# Altium schematic sheet buffNlvlshifter2.SchDoc
size Letter
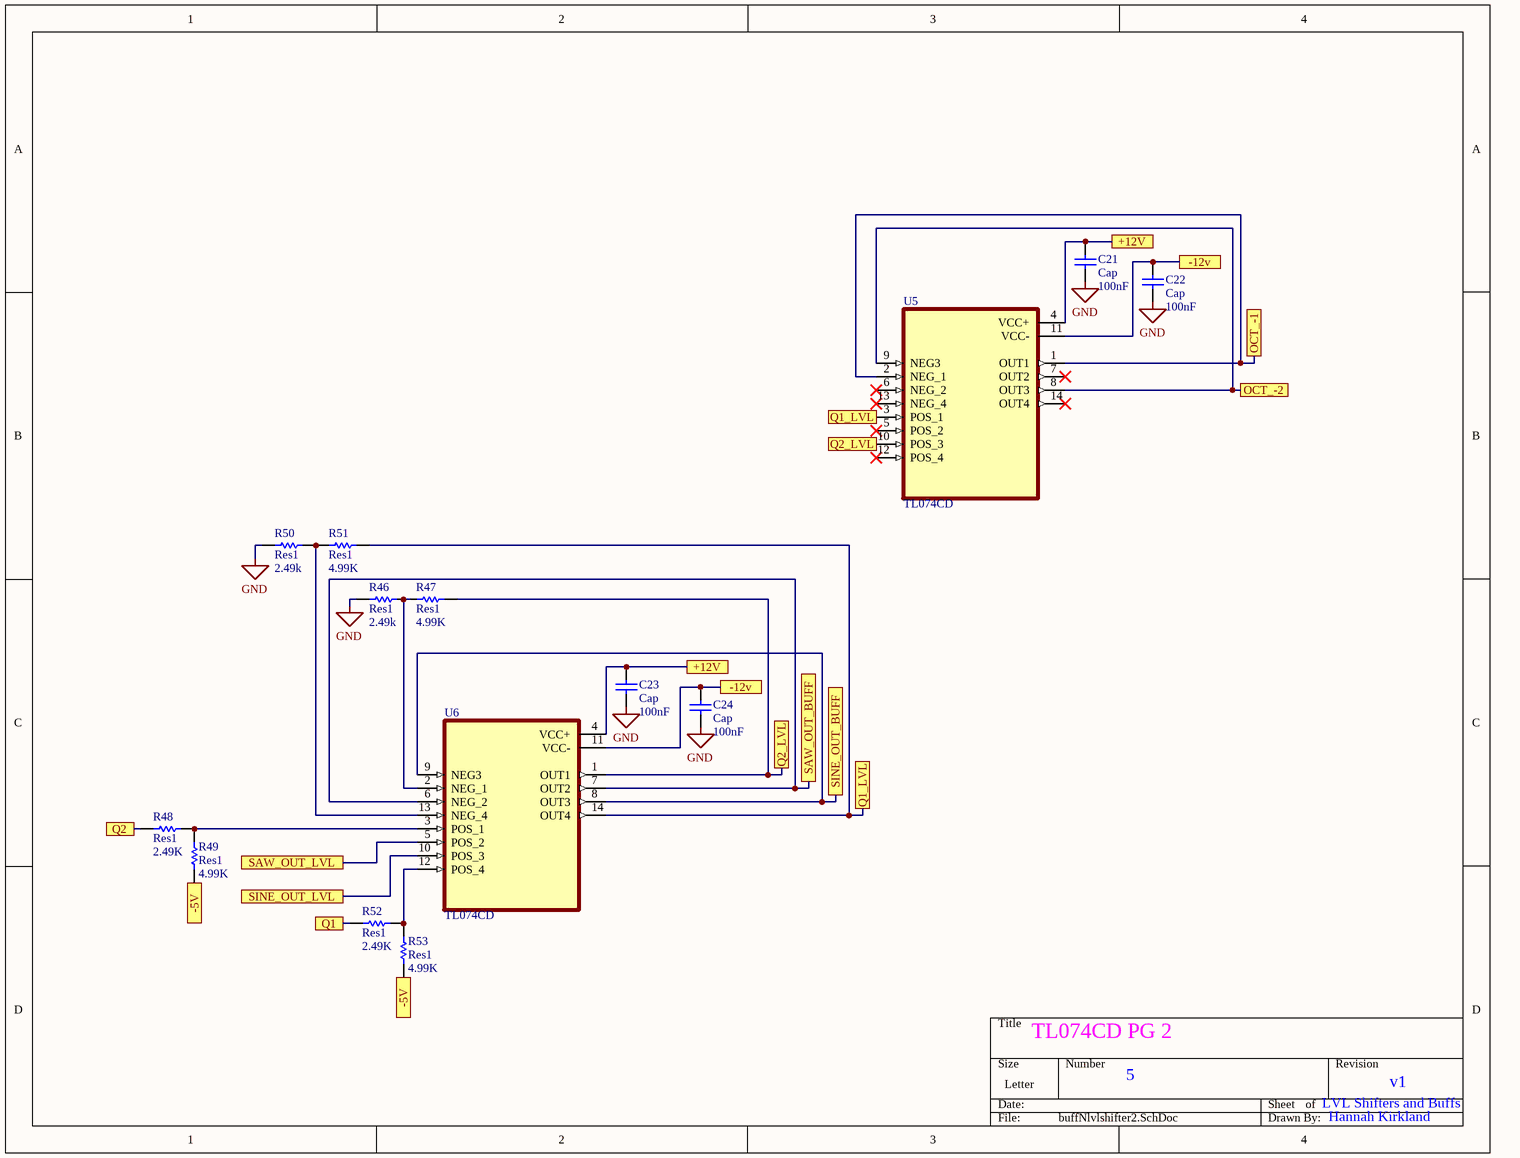
[diagram p0: buffNlvlshifter2.SchDoc]

## Parts
C21  Cap  value 100nF  [C1206]
C22  Cap  value 100nF  [C1206]
C23  Cap  value 100nF  [C1206]
C24  Cap  value 100nF  [C1206]
R46  Res1  value 2.49k  [C1206]
R47  Res1  value 4.99K  [C1206]
R48  Res1  value 2.49K  [C1206]
R49  Res1  value 4.99K  [C1206]
R50  Res1  value 2.49k  [C1206]
R51  Res1  value 4.99K  [C1206]
R52  Res1  value 2.49K  [C1206]
R53  Res1  value 4.99K  [C1206]
U5  TL074CD  [SOIC127P600X175-14N]
U6  TL074CD  [SOIC127P600X175-14N]

## Ports
+12V, -5V, -12v, OCT_-1, OCT_-2, Q1, Q1_LVL, Q2, Q2_LVL, SAW_OUT_BUFF, SAW_OUT_LVL, SINE_OUT_BUFF, SINE_OUT_LVL

## Nets
GND: C21.1 C22.1 C23.1 C24.1 R46.1 R50.1
+12V: C21.2 C23.2 U5.4(VCC+) U6.4(VCC+) ; port +12V
-5V: R49.1 R53.1 ; port -5V
-12v: C22.2 C24.2 U5.11(VCC-) U6.11(VCC-) ; port -12v
OCT_-1: U5.1(OUT1) U5.2(NEG_1) ; port OCT_-1
OCT_-2: U5.8(OUT3) U5.9(NEG3) ; port OCT_-2
Q1: R52.1 ; port Q1
Q1_LVL: R51.2 U5.3(POS_1) U6.14(OUT4) ; port Q1_LVL
Q2: R48.1 ; port Q2
Q2_LVL: R47.2 U5.10(POS_3) U6.1(OUT1) ; port Q2_LVL
SAW_OUT_BUFF: U6.6(NEG_2) U6.7(OUT2) ; port SAW_OUT_BUFF
SAW_OUT_LVL: U6.5(POS_2) ; port SAW_OUT_LVL
SINE_OUT_BUFF: U6.8(OUT3) U6.9(NEG3) ; port SINE_OUT_BUFF
SINE_OUT_LVL: U6.10(POS_3) ; port SINE_OUT_LVL
NetR46_2: R46.2 R47.1 U6.2(NEG_1)
NetR48_2: R48.2 R49.2 U6.3(POS_1)
NetR50_2: R50.2 R51.1 U6.13(NEG_4)
NetR52_2: R52.2 R53.2 U6.12(POS_4)

Not connected (* = marked no-connect by the designer): U5 5(POS_2)* 6(NEG_2)* 7(OUT2)* 12(POS_4)* 13(NEG_4)* 14(OUT4)*

## Notes on the sheet
- TL074CD PG 2
- 5
- LVL Shifters and Buffs
- v1
- Hannah Kirkland

## Library data of the parts
C21-C24 = Cap: Capacitor; Published: 8-Jun-2000; LatestRevisionDate: 17-Jul-2002; LatestRevisionNote: Re-released for DXP Platform.; PackageReference: RAD-0.3; Publisher: Altium Limited; PackageDescription: Radial Cap, Thru-Hole; 2 Leads; 0.3 in Pin Spacing
R46-R53 = Res1: Resistor; Published: 8-Jun-2000; LatestRevisionDate: 17-Jul-2002; LatestRevisionNote: Re-released for DXP Platform.; PackageReference: AXIAL-0.3; Publisher: Altium Limited; PackageDescription: Axial Device, Thru-Hole; 2 Leads; 0.3 in Pin Spacing
U5 U6 = TL074CD: Quad Low-Noise JFET-Input General-Purpose Operational Amplifier 14-SOIC 0 to 70; MF: Texas Instruments; Availability: Good; Mouser-Purchase-URL: https://snapeda.com/shop?store=Mouser&id=4793449; Value: *; SnapEDA_Link: https://www.snapeda.com/parts/TL074CD/Texas%20Instruments/view-part/4793449/?ref=snap; Texas_Instruments-Purchase-URL: https://snapeda.com/shop?store=Texas+Instruments&id=4793449; Price: None; Package: SOIC-14 Texas Instruments; MP: TL074CD; DigiKey-Purchase-URL: https://snapeda.com/shop?store=DigiKey&id=4793449; BuyPart: https://www.snapeda.com/parts/TL074CD/Texas%20Instruments/view-part/4793449/?ref=eda